# Altium schematic sheet wifi.SchDoc
size A4
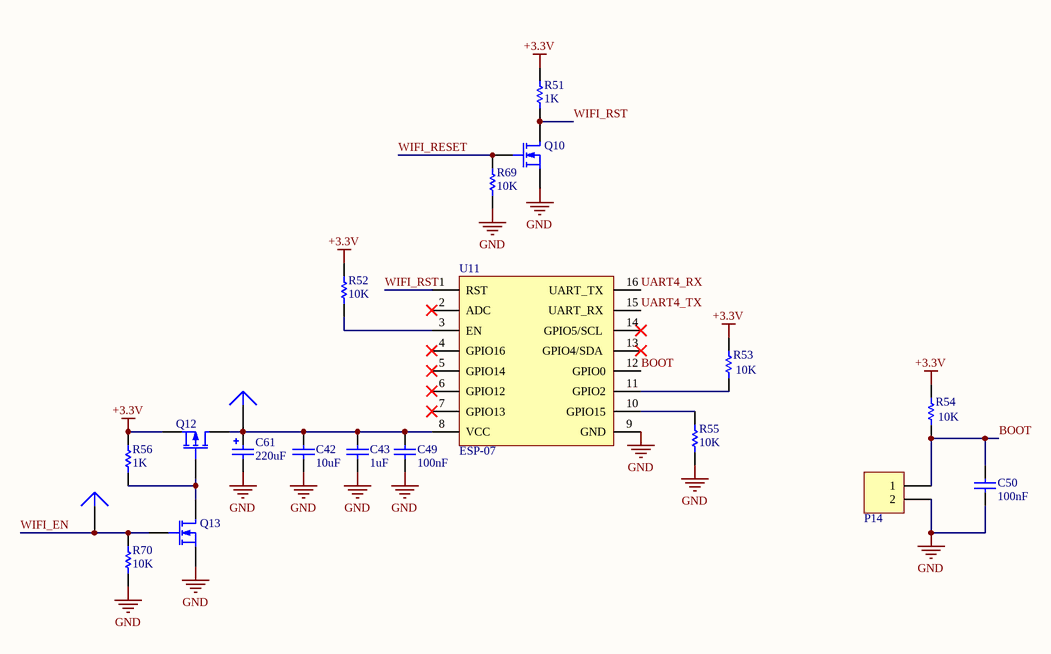
[diagram p0: wifi.SchDoc]

## Parts
C42  value 10uF  [C0402]  (hidden comment: Cap 10uF)
C43  value 1uF  [C0402]  (hidden comment: Cap 1uF)
C49  value 100nF  [C0402]  (hidden comment: Cap 100nF)
C50  value 100nF  [C0402]  (hidden comment: Cap 100nF)
C61  value 220uF  [CAP-D]  (hidden comment: Tantalum 220uF)
P14  Header 2  [HDR1X2]  (value not drawn)
P25  Plug  [pin smd]  (value not drawn)  (no BOM)
P29  Plug  [pin smd]  (value not drawn)  (no BOM)
Q10  AO3400A  [SOT23]  (value not drawn)
Q12  AO3401A  [SOT23]  (value not drawn)
Q13  AO3400A  [SOT23]  (value not drawn)
R51  value 1K  [R0402]  (hidden comment: Res_1K)
R52  value 10K  [R0402]  (hidden comment: Res_10K)
R53  value 10K  [R0402]  (hidden comment: Res_10K)
R54  value 10K  [R0402]  (hidden comment: Res_10K)
R55  value 10K  [R0402]  (hidden comment: Res_10K)
R56  value 1K  [R0402]  (hidden comment: Res_1K)
R69  value 10K  [R0402]  (hidden comment: Res_10K)
R70  value 10K  [R0402]  (hidden comment: Res_10K)
U11  ESP-07  [ESP-07]

## Nets
+3.3V: Q12.2(S) R51.2 R52.2 R53.2 R54.2 R56.2
GND: C42.1 C43.1 C49.1 C50.1 C61.1 P14.2 Q10.2(S) Q13.2(S) R55.1 R69.1 R70.1 U11.9(GND)
BOOT: C50.2 P14.1 R54.1 U11.12(GPIO0)
UART4_RX: U11.16(UART_TX)
UART4_TX: U11.15(UART_RX)
WIFI_EN: P29.1 Q13.1(G) R70.2
WIFI_RESET: Q10.1(G) R69.2
WIFI_RST: Q10.3(D) R51.1 U11.1(RST)
NetC42_2: C42.2 C43.2 C49.2 C61.2 P25.1 Q12.3(D) U11.8(VCC)
NetQ12_1: Q12.1(G) Q13.3(D) R56.1
NetR52_1: R52.1 U11.3(EN)
NetR53_1: R53.1 U11.11(GPIO2)
NetR55_2: R55.2 U11.10(GPIO15)

Not connected (* = marked no-connect by the designer): U11 2(ADC)* 4(GPIO16)* 5(GPIO14)* 6(GPIO12)* 7(GPIO13)* 13(GPIO4/SDA)* 14(GPIO5/SCL)*

## Library data of the parts
C42 = Cap 10uF: Capacitor
C43 = Cap 1uF: Capacitor
C49 C50 = Cap 100nF: Capacitor
C61 = Tantalum 220uF: Polarized Tantalum Capacitor
P14 = Header 2: Header, 2-Pin; LatestRevisionDate: 17-Jul-2002; LatestRevisionNote: Re-released for DXP Platform.; Publisher: Altium Limited
Q10 Q13 = MOSFET-N: N-MOSFET AO3400A; Published: 8-Jun-2000; LatestRevisionDate: 17-Jul-2002; LatestRevisionNote: Re-released for DXP Platform.; PackageVersion: 1995/1996; PackageReference: E3; Publisher: Altium Limited; PackageDescription: TO, Flat Index; 3 In-Line, Axial Leads; Body Dia. 4.6mm; Lead Dia. 0.5 mm (max); ComponentLink1Description: datasheet; ComponentLink1URL: https://datasheet.lcsc.com/szlcsc/1908271131_Youtai-Semiconductor-Co-Ltd-AO3400A_C347475.pdf
Q12 = MOSFET-P: P-Channel MOSFET AO3401A; Published: 8-Jun-2000; LatestRevisionDate: 17-Jul-2002; LatestRevisionNote: Re-released for DXP Platform.; PackageVersion: 1995/1996; PackageReference: E3; Publisher: Altium Limited; PackageDescription: TO, Flat Index; 3 In-Line, Axial Leads; Body Dia. 4.6mm; Lead Dia. 0.5 mm (max); ComponentLink1Description: datasheet; ComponentLink1URL: https://datasheet.lcsc.com/szlcsc/Alpha-Omega-Semicon-AOS-AO3401A_C15127.pdf
R51 R56 = Res_1K: Resistor
R52-R55 R69 R70 = Res_10K: Resistor
U11 = ESP-07: AiThinker ESP-07; ComponentLink1Description: datasheet; ComponentLink1URL: http://wiki.ai-thinker.com/_media/esp8266/esp8266_series_modules_user_manual_v1.1.pdf
P25 P29 = Plug: LatestRevisionDate: 17-Jul-2002; LatestRevisionNote: Re-released for DXP Platform.; Publisher: Altium Limited